# Altium schematic sheet Power.SchDoc: Power.SchDoc
size A4; CheckedBy: fx; Author: flotox@yeah.net; Revision: v1.0.0; SheetNumber: 4; SheetTotal: 10
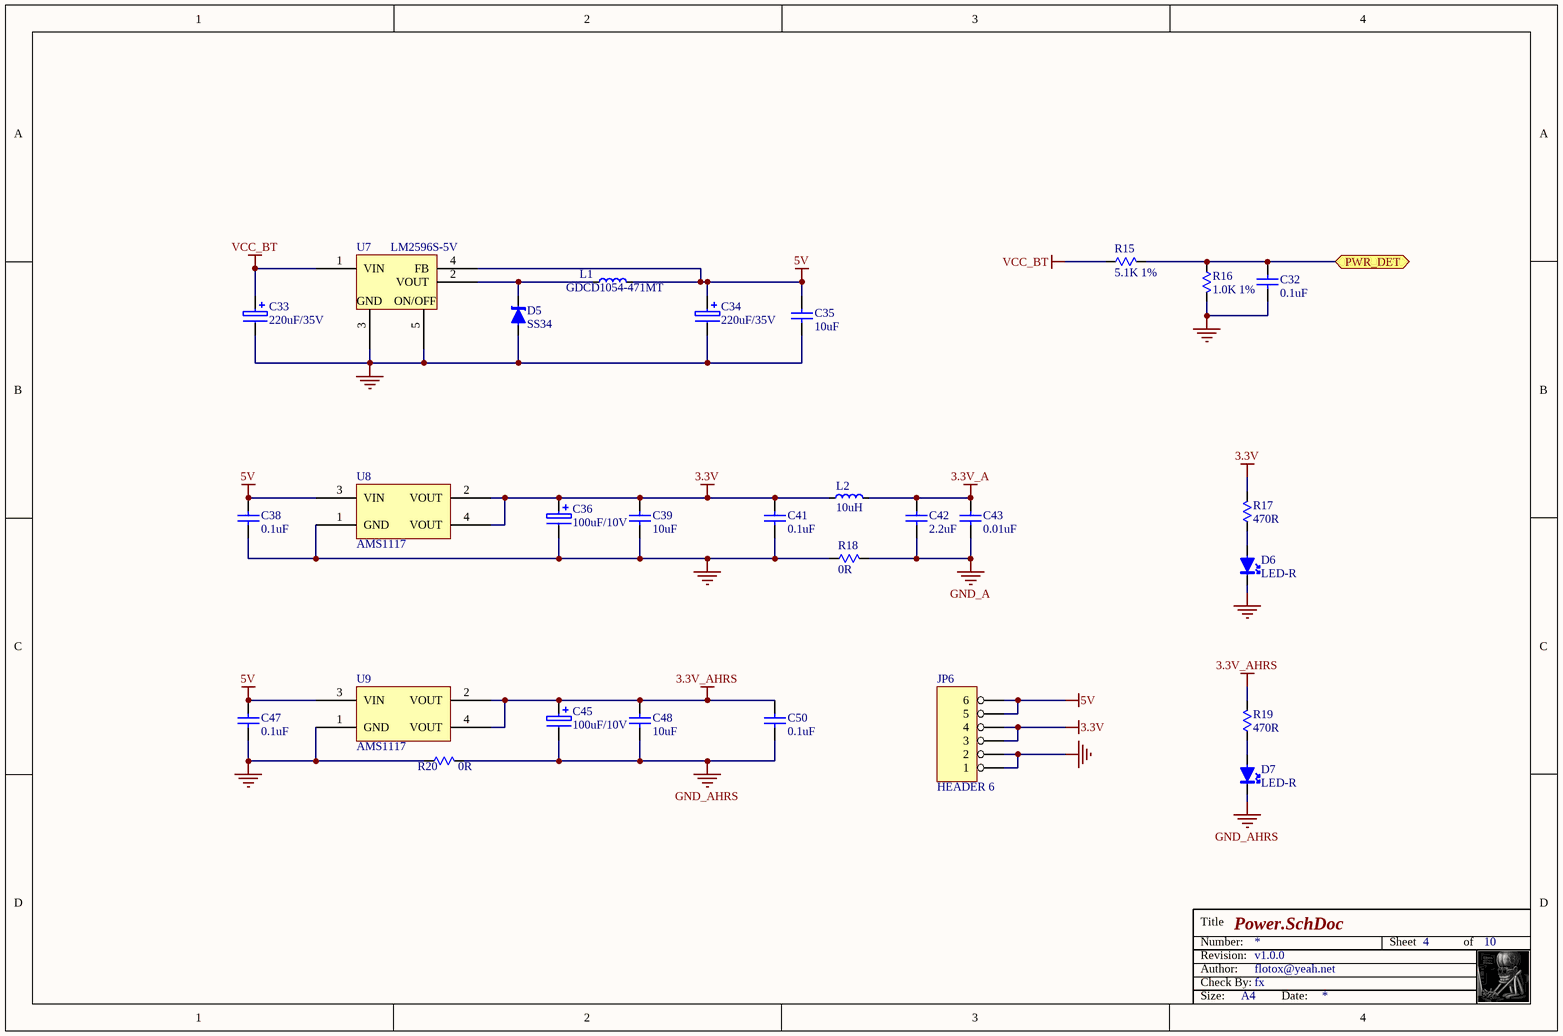
[diagram p0: Power.SchDoc]

## Parts
C32  0.1uF  [C0603-S]
C33  220uF/35V  [CAPPR-8.3X8.3-SM-F]
C34  220uF/35V  [CAPPR-8.3X8.3-SM-F]
C35  10uF  [C0603-S]
C36  100uF/10V  [CAPPR-5.3X5.3-SM-C]
C38  0.1uF  [C0603-S]
C39  10uF  [C0603-S]
C41  0.1uF  [C0603-S]
C42  2.2uF  [C0603-S]
C43  0.01uF  [C0603-S]
C45  100uF/10V  [CAPPR-5.3X5.3-SM-C]
C47  0.1uF  [C0603-S]
C48  10uF  [C0603-S]
C50  0.1uF  [C0603-S]
D5  SS34  [SMB]
D6  LED-R  [LED0603]
D7  LED-R  [LED0603]
JP6  HEADER 6  [WHDR2.0X6]
L1  GDCD1054-471MT  [GDCD1054]
L2  10uH  [L0603-C]
R15  5.1K 1%  [R0603-S]
R16  1.0K 1%  [R0603-S]
R17  470R  [R0603-S]
R18  0R  [R0805-S]
R19  470R  [R0603-S]
R20  0R  [R0805-S]
U7  LM2596S-5V  [D2PAK]
U8  AMS1117  [SOT-223]
U9  AMS1117  [SOT-223]

## Ports
PWR_DET

## Nets
3.3V: C36.1 C39.2 C41.2 JP6.3 JP6.4 L2.1 R17.1 U8.2(VOUT) U8.4(VOUT)
3.3V_A: C42.2 C43.2 L2.2
3.3V_AHRS: C45.1 C48.2 C50.2 R19.1 U9.2(VOUT) U9.4(VOUT)
5V: C34.1 C35.2 C38.2 C47.2 JP6.5 JP6.6 L1.2 U7.4(FB) U8.3(VIN) U9.3(VIN)
GND: C32.1 C33.2 C34.2 C35.1 C36.2 C38.1 C39.1 C41.1 C47.1 D5.1(A) D6.2(K) JP6.1 JP6.2 R16.1 R18.2 R20.2 U7.3(GND) U7.5(ON/OFF) U8.1(GND) U9.1(GND)
GND_A: C42.1 C43.1 R18.1
GND_AHRS: C45.2 C48.1 C50.1 D7.2(K) R20.1
VCC_BT: C33.1 R15.2 U7.1(VIN)
PWR_DET: C32.2 R15.1 R16.2 ; port PWR_DET
NetD5_2: D5.2(K) L1.1 U7.2(VOUT)
NetD6_1: D6.1(A) R17.2
NetD7_1: D7.1(A) R19.2

## Notes on the sheet
- Title
- Revision:
- Number:
- Author:
- Check By:
- Sheet
- of
- Size:
- A4
- Date:

## Library data of the parts
C32 C35 C38 C39 C41-C43 C47 C48 C50 = CAP: Capacitor
C33 C34 C36 C45 = CAP-ELEC: Polarized Capacitor
D5 = DIODE-SBD: Schottky barrier rectifier
D6 D7 = LED: Light Emitting Diode
L1 L2 = INDUCT: Inductor
R15-R20 = RES: Resistor
U7 = LM2596
U8 U9 = AMS1117: 800mA Low-Dropout Linear Regulator